# Altium schematic sheet 04_FPGA Bank500_Bank501.SchDoc
size 297 x 209 mm
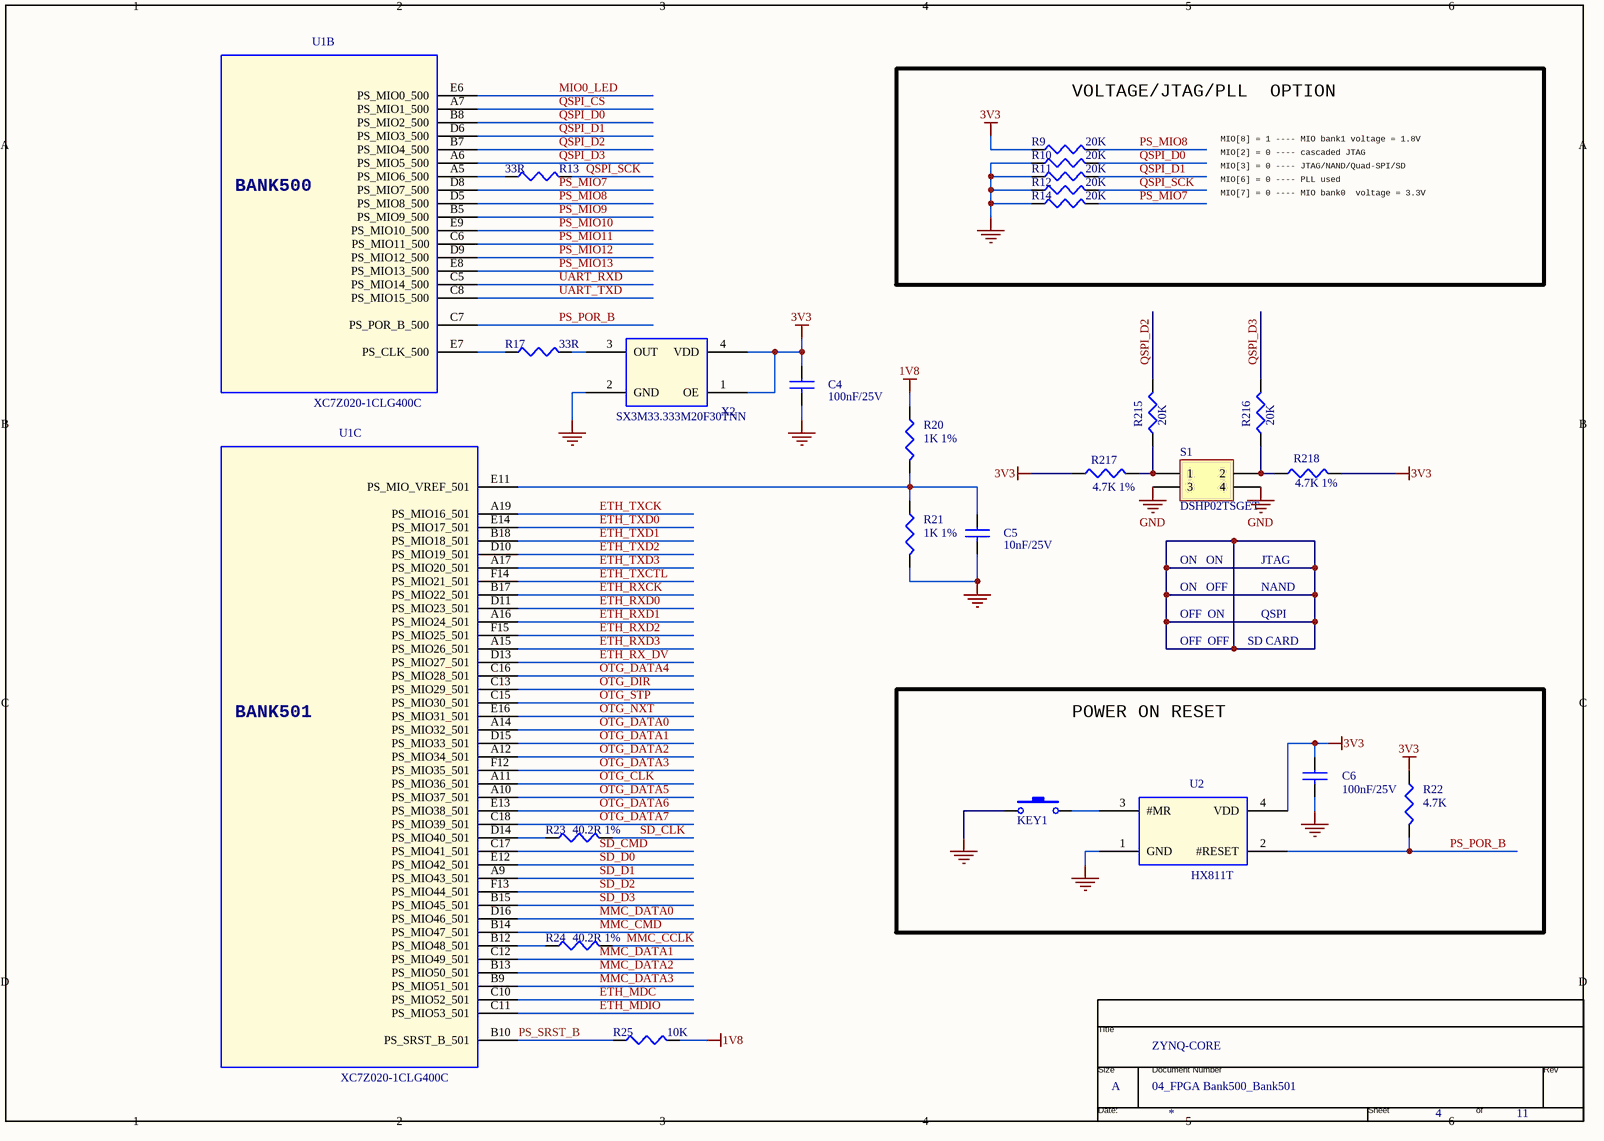
[diagram p0: 04_FPGA Bank500_Bank501.SchDoc]

## Parts
*  Page Count: 11  Page Number: 4  Page Size: A  Title: ZYNQ-CORE  Doc: 04_FPGA Bank500_Bank501  (hidden comment: TitleBlock0)  (graphical)
C4  100nF/25V  [C0402]
C5  10nF/25V  [C0402]
C6  100nF/25V  [C0402]
KEY1  TS-1071AD-A1B3-D4  [KEY_3*4*2]  (value not drawn)
R9  20K  [R0402]
R10  20K  [R0402]
R11  20K  [R0402]
R12  20K  [R0402]
R13  33R  [R0402]
R14  20K  [R0402]
R17  33R  [R0402]
R20  1K 1%  [R0402]
R21  1K 1%  [R0402]
R22  4.7K  [R0402]
R23  40.2R 1%  [R0402]
R24  40.2R 1%  [R0402]
R25  10K  [R0402]
R215  20K  [R0402]
R216  20K  [R0402]
R217  4.7K 1%  [R0402]
R218  4.7K 1%  [R0402]
S1  DSHP02TSGET  [KE-1.27-2Pin]
U1  XC7Z020-1CLG400C  [CLG400]  (parts B,C of 9)
U2  HX811T  [TCM811TERCTR]
X2  SX3M33.333M20F30TNN  [OSC3_2X2_5]

## Blocks framed on the sheet
VOLTAGE/JTAG/PLL  OPTION: R9-R12 R14
POWER ON RESET: C6 KEY1 R22 U2

## Nets
1V8: R20.1 R25.2
3V3: C4.1 C6.1 R9.1 R22.1 R217.1 R218.2 U2.4(VDD) X2.1(OE) X2.4(VDD)
GND: C4.2 C5.2 C6.2 KEY1.1 R10.1 R11.1 R12.1 R14.1 R21.2 S1.3 S1.4 U2.1(GND) X2.2(GND)
ETH_MDC: U1.C10(PS_MIO52_501)
ETH_MDIO: U1.C11(PS_MIO53_501)
ETH_RX_DV: U1.D13(PS_MIO27_501)
ETH_RXCK: U1.B17(PS_MIO22_501)
ETH_RXD0: U1.D11(PS_MIO23_501)
ETH_RXD1: U1.A16(PS_MIO24_501)
ETH_RXD2: U1.F15(PS_MIO25_501)
ETH_RXD3: U1.A15(PS_MIO26_501)
ETH_TXCK: U1.A19(PS_MIO16_501)
ETH_TXCTL: U1.F14(PS_MIO21_501)
ETH_TXD0: U1.E14(PS_MIO17_501)
ETH_TXD1: U1.B18(PS_MIO18_501)
ETH_TXD2: U1.D10(PS_MIO19_501)
ETH_TXD3: U1.A17(PS_MIO20_501)
MIO0_LED: U1.E6(PS_MIO0_500)
MMC_CCLK: R24.2
MMC_CMD: U1.B14(PS_MIO47_501)
MMC_DATA0: U1.D16(PS_MIO46_501)
MMC_DATA1: U1.C12(PS_MIO49_501)
MMC_DATA2: U1.B13(PS_MIO50_501)
MMC_DATA3: U1.B9(PS_MIO51_501)
OTG_CLK: U1.A11(PS_MIO36_501)
OTG_DATA0: U1.A14(PS_MIO32_501)
OTG_DATA1: U1.D15(PS_MIO33_501)
OTG_DATA2: U1.A12(PS_MIO34_501)
OTG_DATA3: U1.F12(PS_MIO35_501)
OTG_DATA4: U1.C16(PS_MIO28_501)
OTG_DATA5: U1.A10(PS_MIO37_501)
OTG_DATA6: U1.E13(PS_MIO38_501)
OTG_DATA7: U1.C18(PS_MIO39_501)
OTG_DIR: U1.C13(PS_MIO29_501)
OTG_NXT: U1.E16(PS_MIO31_501)
OTG_STP: U1.C15(PS_MIO30_501)
PS_MIO7: R14.2 U1.D8(PS_MIO7_500)
PS_MIO8: R9.2 U1.D5(PS_MIO8_500)
PS_MIO9: U1.B5(PS_MIO9_500)
PS_MIO10: U1.E9(PS_MIO10_500)
PS_MIO11: U1.C6(PS_MIO11_500)
PS_MIO12: U1.D9(PS_MIO12_500)
PS_MIO13: U1.E8(PS_MIO13_500)
PS_POR_B: R22.2 U1.C7(PS_POR_B_500) U2.2(#RESET)
PS_SRST_B: R25.1 U1.B10(PS_SRST_B_501)
QSPI_CS: U1.A7(PS_MIO1_500)
QSPI_D0: R10.2 U1.B8(PS_MIO2_500)
QSPI_D1: R11.2 U1.D6(PS_MIO3_500)
QSPI_D2: R215.2 U1.B7(PS_MIO4_500)
QSPI_D3: R216.2 U1.A6(PS_MIO5_500)
QSPI_SCK: R12.2 R13.2
SD_CLK: R23.2
SD_CMD: U1.C17(PS_MIO41_501)
SD_D0: U1.E12(PS_MIO42_501)
SD_D1: U1.A9(PS_MIO43_501)
SD_D2: U1.F13(PS_MIO44_501)
SD_D3: U1.B15(PS_MIO45_501)
UART_RXD: U1.C5(PS_MIO14_500)
UART_TXD: U1.C8(PS_MIO15_500)
NetC5_1: C5.1 R20.2 R21.1 U1.E11(PS_MIO_VREF_501)
NetKEY1_2: KEY1.2 U2.3(#MR)
NetR13_1: R13.1 U1.A5(PS_MIO6_500)
NetR17_1: R17.1 U1.E7(PS_CLK_500)
NetR17_2: R17.2 X2.3(OUT)
NetR23_1: R23.1 U1.D14(PS_MIO40_501)
NetR24_1: R24.1 U1.B12(PS_MIO48_501)
NetR215_1: R215.1 R217.2 S1.1
NetR216_1: R216.1 R218.1 S1.2

## Notes on the sheet
- MIO[8] = 1 ---- MIO bank1 voltage = 1.8V
- MIO[2] = 0 ---- cascaded JTAG
- MIO[3] = 0 ---- JTAG/NAND/Quad-SPI/SD
- MIO[6] = 0 ---- PLL used
- MIO[7] = 0 ---- MIO bank0  voltage = 3.3V
- ON   ON
- ON   OFF
- NAND
- JTAG
- OFF  ON
- OFF  OFF
- SD CARD
- QSPI
- (in symbol TitleBlock0) Title; Size; Document Number; Rev; Date:; Sheet; of
- (in symbol Zynq7010/7020, part B) BANK500
- (in symbol Zynq7010/7020, part C) BANK501

## Library data of the parts
C4-C6 = CAP NP_Dup1: PCB Footprint: C0402
KEY1 = switch-anniu
R9-R14 R17 R20-R25 R215-R218 = RESISTOR_Dup1: PCB Footprint: R0402
S1 = Header 2X2: 拨码开关; LatestRevisionDate: 17-Jul-2002; LatestRevisionNote: Re-released for DXP Platform.; Publisher: Altium Limited
U1 = Zynq7010/7020: PCB Footprint: CLG400
U2 = TCM811TERCTR: PCB Footprint: TCM811TERCTR
X2 = crystal_active: PCB Footprint: OSC3_2X2_5
* = TitleBlock0: Page Create Date: March  8, 1995; Page Modify Date: *